# EAGLE design Solar LEDs (EAGLE 9.6.2)
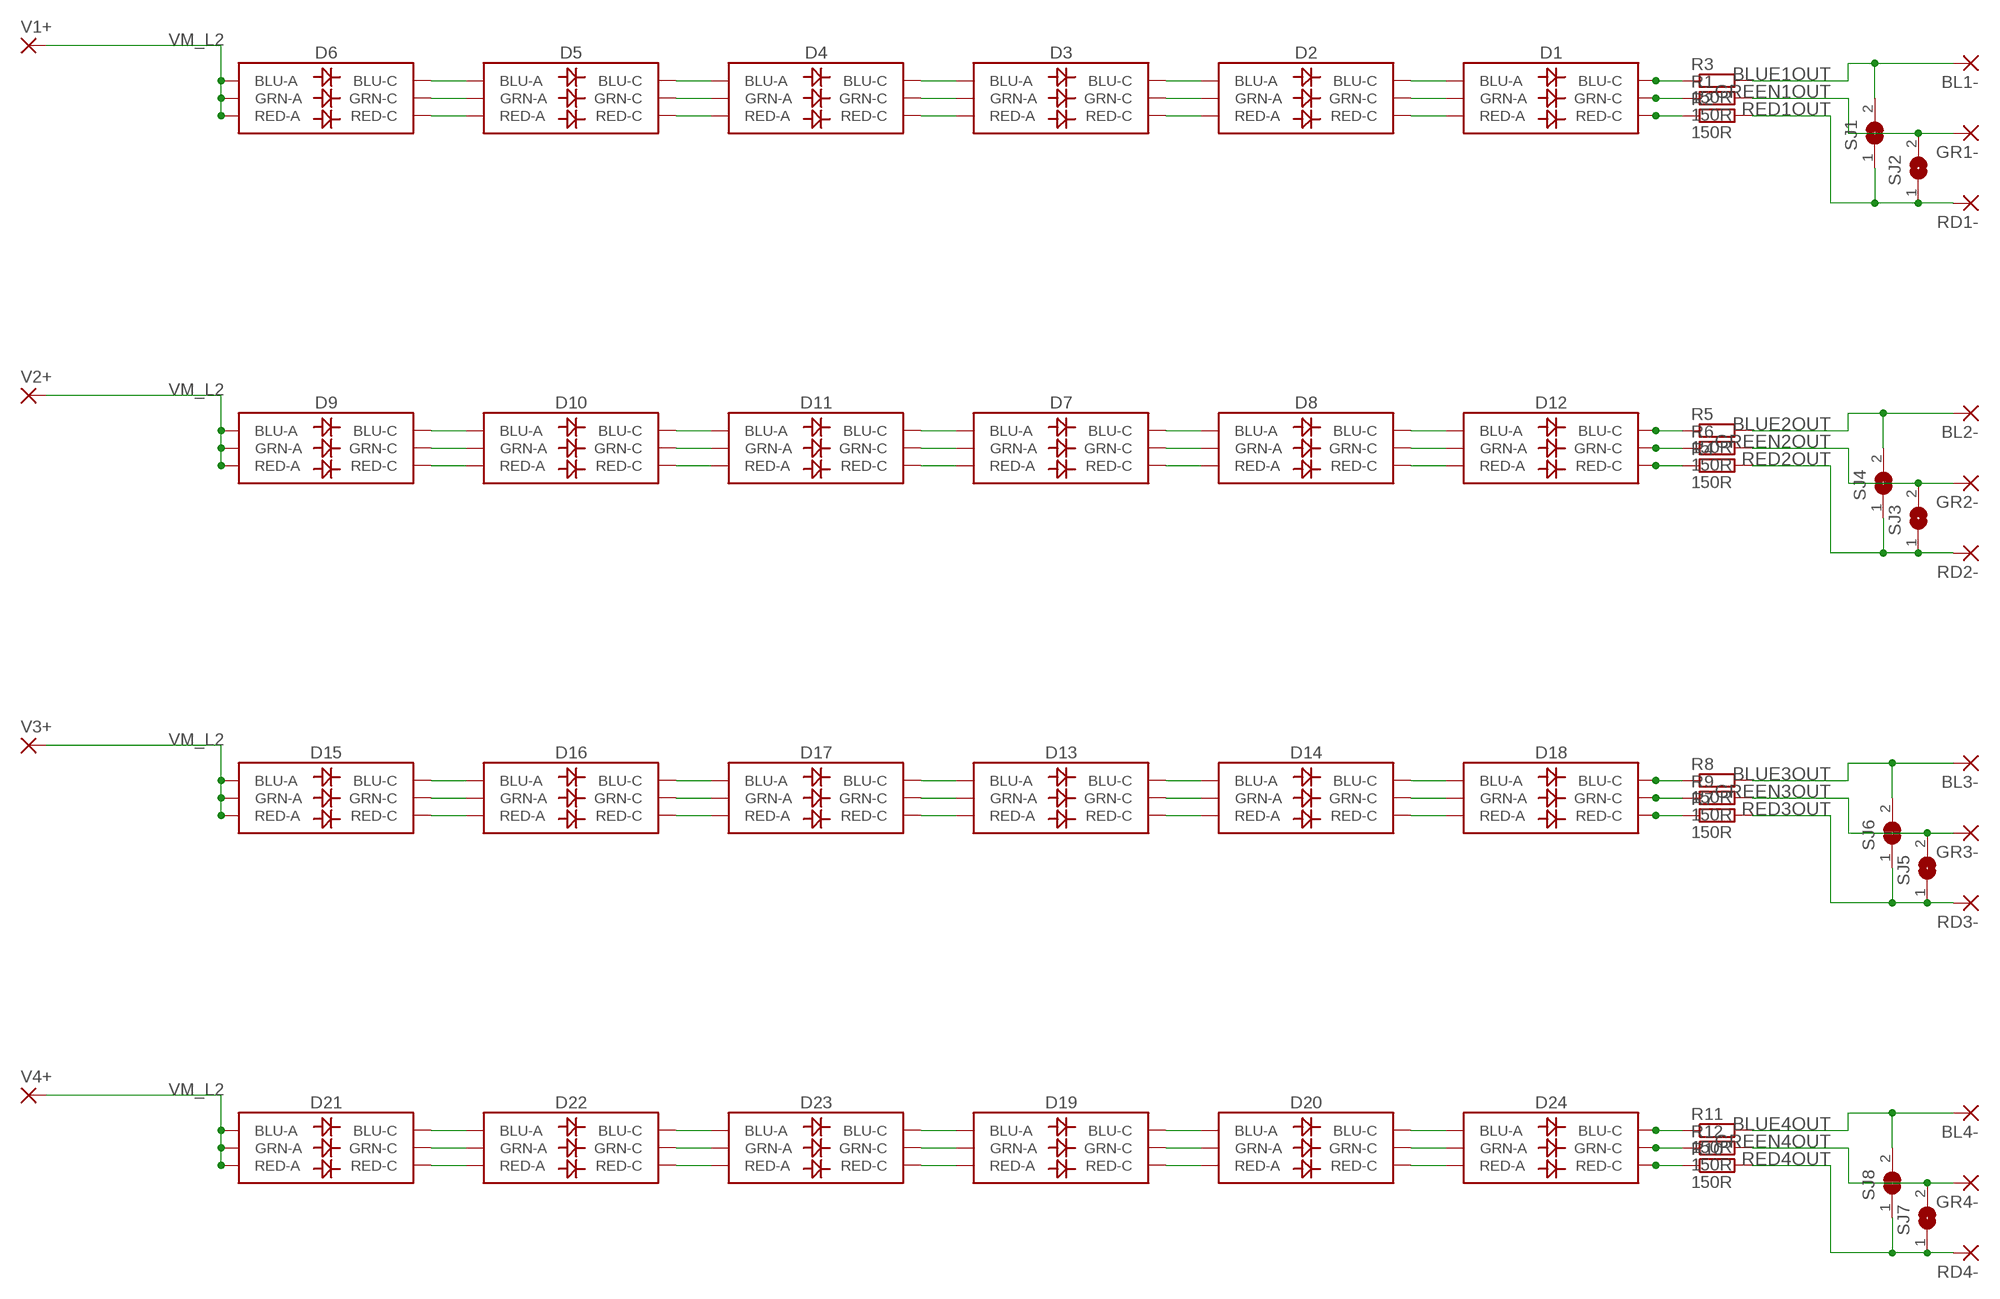
[diagram p0: schematic, sheet 1]

## Parts
BL1-  2,54/1,0  [2,54/1,0]
BL2-  2,54/1,0  [2,54/1,0]
BL3-  2,54/1,0  [2,54/1,0]
BL4-  2,54/1,0  [2,54/1,0]
D1  LED-RGBNO_IC  [LED-TRICOLOR-5050]
D2  LED-RGBNO_IC  [LED-TRICOLOR-5050]
D3  LED-RGBNO_IC  [LED-TRICOLOR-5050]
D4  LED-RGBNO_IC  [LED-TRICOLOR-5050]
D5  LED-RGBNO_IC  [LED-TRICOLOR-5050]
D6  LED-RGBNO_IC  [LED-TRICOLOR-5050]
D7  LED-RGBNO_IC  [LED-TRICOLOR-5050]
D8  LED-RGBNO_IC  [LED-TRICOLOR-5050]
D9  LED-RGBNO_IC  [LED-TRICOLOR-5050]
D10  LED-RGBNO_IC  [LED-TRICOLOR-5050]
D11  LED-RGBNO_IC  [LED-TRICOLOR-5050]
D12  LED-RGBNO_IC  [LED-TRICOLOR-5050]
D13  LED-RGBNO_IC  [LED-TRICOLOR-5050]
D14  LED-RGBNO_IC  [LED-TRICOLOR-5050]
D15  LED-RGBNO_IC  [LED-TRICOLOR-5050]
D16  LED-RGBNO_IC  [LED-TRICOLOR-5050]
D17  LED-RGBNO_IC  [LED-TRICOLOR-5050]
D18  LED-RGBNO_IC  [LED-TRICOLOR-5050]
D19  LED-RGBNO_IC  [LED-TRICOLOR-5050]
D20  LED-RGBNO_IC  [LED-TRICOLOR-5050]
D21  LED-RGBNO_IC  [LED-TRICOLOR-5050]
D22  LED-RGBNO_IC  [LED-TRICOLOR-5050]
D23  LED-RGBNO_IC  [LED-TRICOLOR-5050]
D24  LED-RGBNO_IC  [LED-TRICOLOR-5050]
GR1-  2,54/1,0  [2,54/1,0]
GR2-  2,54/1,0  [2,54/1,0]
GR3-  2,54/1,0  [2,54/1,0]
GR4-  2,54/1,0  [2,54/1,0]
R1  150R  R-EU_M1206  [M1206]
R2  150R  R-EU_M1206  [M1206]
R3  150R  R-EU_M1206  [M1206]
R4  150R  R-EU_M1206  [M1206]
R5  150R  R-EU_M1206  [M1206]
R6  150R  R-EU_M1206  [M1206]
R7  150R  R-EU_M1206  [M1206]
R8  150R  R-EU_M1206  [M1206]
R9  150R  R-EU_M1206  [M1206]
R10  150R  R-EU_M1206  [M1206]
R11  150R  R-EU_M1206  [M1206]
R12  150R  R-EU_M1206  [M1206]
RD1-  2,54/1,0  [2,54/1,0]
RD2-  2,54/1,0  [2,54/1,0]
RD3-  2,54/1,0  [2,54/1,0]
RD4-  2,54/1,0  [2,54/1,0]
SJ1  SJ  [SJ]
SJ2  SJ  [SJ]
SJ3  SJ  [SJ]
SJ4  SJ  [SJ]
SJ5  SJ  [SJ]
SJ6  SJ  [SJ]
SJ7  SJ  [SJ]
SJ8  SJ  [SJ]
V1+  2,54/1,0  [2,54/1,0]
V2+  2,54/1,0  [2,54/1,0]
V3+  2,54/1,0  [2,54/1,0]
V4+  2,54/1,0  [2,54/1,0]

## Nets
BLUE1OUT: BL1-.1(P) R3.2 SJ1.2
BLUE2OUT: BL2-.1(P) R5.2 SJ4.2
BLUE3OUT: BL3-.1(P) R8.2 SJ6.2
BLUE4OUT: BL4-.1(P) R11.2 SJ8.2
GREEN1OUT: GR1-.1(P) R1.2 SJ2.2
GREEN2OUT: GR2-.1(P) R6.2 SJ3.2
GREEN3OUT: GR3-.1(P) R9.2 SJ5.2
GREEN4OUT: GR4-.1(P) R12.2 SJ7.2
N$2: D9.4(BLU-C) D10.3(BLU-A)
N$3: D9.6(GRN-C) D10.1(GRN-A)
N$4: D9.5(RED-C) D10.2(RED-A)
N$5: D10.4(BLU-C) D11.3(BLU-A)
N$6: D10.6(GRN-C) D11.1(GRN-A)
N$7: D10.5(RED-C) D11.2(RED-A)
N$8: D7.3(BLU-A) D11.4(BLU-C)
N$9: D7.1(GRN-A) D11.6(GRN-C)
N$10: D7.2(RED-A) D11.5(RED-C)
N$11: D7.4(BLU-C) D8.3(BLU-A)
N$12: D7.6(GRN-C) D8.1(GRN-A)
N$13: D7.5(RED-C) D8.2(RED-A)
N$14: D8.4(BLU-C) D12.3(BLU-A)
N$15: D8.6(GRN-C) D12.1(GRN-A)
N$16: D8.5(RED-C) D12.2(RED-A)
N$17: D12.4(BLU-C) R5.1
N$18: D12.6(GRN-C) R6.1
N$19: D5.3(BLU-A) D6.4(BLU-C)
N$20: D5.1(GRN-A) D6.6(GRN-C)
N$21: D5.2(RED-A) D6.5(RED-C)
N$22: D4.3(BLU-A) D5.4(BLU-C)
N$23: D4.1(GRN-A) D5.6(GRN-C)
N$24: D4.2(RED-A) D5.5(RED-C)
N$25: D3.3(BLU-A) D4.4(BLU-C)
N$26: D3.1(GRN-A) D4.6(GRN-C)
N$27: D3.2(RED-A) D4.5(RED-C)
N$28: D2.3(BLU-A) D3.4(BLU-C)
N$29: D2.1(GRN-A) D3.6(GRN-C)
N$30: D2.2(RED-A) D3.5(RED-C)
N$31: D1.3(BLU-A) D2.4(BLU-C)
N$32: D1.1(GRN-A) D2.6(GRN-C)
N$33: D1.2(RED-A) D2.5(RED-C)
N$34: D12.5(RED-C) R4.1
N$35: D15.4(BLU-C) D16.3(BLU-A)
N$36: D15.6(GRN-C) D16.1(GRN-A)
N$37: D15.5(RED-C) D16.2(RED-A)
N$38: D16.4(BLU-C) D17.3(BLU-A)
N$39: D16.6(GRN-C) D17.1(GRN-A)
N$40: D16.5(RED-C) D17.2(RED-A)
N$41: D13.3(BLU-A) D17.4(BLU-C)
N$42: D13.1(GRN-A) D17.6(GRN-C)
N$43: D1.4(BLU-C) R3.1
N$44: D1.6(GRN-C) R1.1
N$45: D1.5(RED-C) R2.1
N$46: D13.2(RED-A) D17.5(RED-C)
N$47: D13.4(BLU-C) D14.3(BLU-A)
N$48: D13.6(GRN-C) D14.1(GRN-A)
N$49: D13.5(RED-C) D14.2(RED-A)
N$50: D14.4(BLU-C) D18.3(BLU-A)
N$51: D14.6(GRN-C) D18.1(GRN-A)
N$52: D14.5(RED-C) D18.2(RED-A)
N$53: D18.4(BLU-C) R8.1
N$54: D18.6(GRN-C) R9.1
N$55: D18.5(RED-C) R7.1
N$56: D21.4(BLU-C) D22.3(BLU-A)
N$57: D21.6(GRN-C) D22.1(GRN-A)
N$58: D21.5(RED-C) D22.2(RED-A)
N$59: D22.4(BLU-C) D23.3(BLU-A)
N$60: D22.6(GRN-C) D23.1(GRN-A)
N$61: D22.5(RED-C) D23.2(RED-A)
N$62: D19.3(BLU-A) D23.4(BLU-C)
N$63: D19.1(GRN-A) D23.6(GRN-C)
N$64: D19.2(RED-A) D23.5(RED-C)
N$65: D19.4(BLU-C) D20.3(BLU-A)
N$66: D19.6(GRN-C) D20.1(GRN-A)
N$67: D19.5(RED-C) D20.2(RED-A)
N$68: D20.4(BLU-C) D24.3(BLU-A)
N$69: D20.6(GRN-C) D24.1(GRN-A)
N$70: D20.5(RED-C) D24.2(RED-A)
N$71: D24.4(BLU-C) R11.1
N$72: D24.6(GRN-C) R12.1
N$73: D24.5(RED-C) R10.1
RED1OUT: R2.2 RD1-.1(P) SJ1.1 SJ2.1
RED2OUT: R4.2 RD2-.1(P) SJ3.1 SJ4.1
RED3OUT: R7.2 RD3-.1(P) SJ5.1 SJ6.1
RED4OUT: R10.2 RD4-.1(P) SJ7.1 SJ8.1
VM_L2: D6.1(GRN-A) D6.2(RED-A) D6.3(BLU-A) D9.1(GRN-A) D9.2(RED-A) D9.3(BLU-A) D15.1(GRN-A) D15.2(RED-A) D15.3(BLU-A) D21.1(GRN-A) D21.2(RED-A) D21.3(BLU-A) V1+.1(P) V2+.1(P) V3+.1(P) V4+.1(P)

## Library data of the parts
BL1- BL2- BL3- BL4- GR1- GR2- GR3- GR4- RD1- RD2- RD3- RD4- V1+ V2+ V3+ V4+ = wirepad:2,54/1,0: THROUGH-HOLE PAD
D1-D24 = SparkFun-LED:LED-RGB: LED-RGB 6 pin RGB LED (no common connector) Packages: PLCC-6 LED-TRICOLOR-5050 - No built-in IC SparkFun Products: Digital Sandbox <https://www.sparkfun.com/products/12651> LED- SMD RGB <https://www.sparkfun.com/products/10866>; PROD_ID: DIO-10298
R1-R12 = rcl:R-EU_: RESISTOR, European symbol
SJ1-SJ8 = jumper:SJ: SMD solder JUMPER

## Net classes
0 default: width 0.203 mm, clearance 0.152 mm

## Board
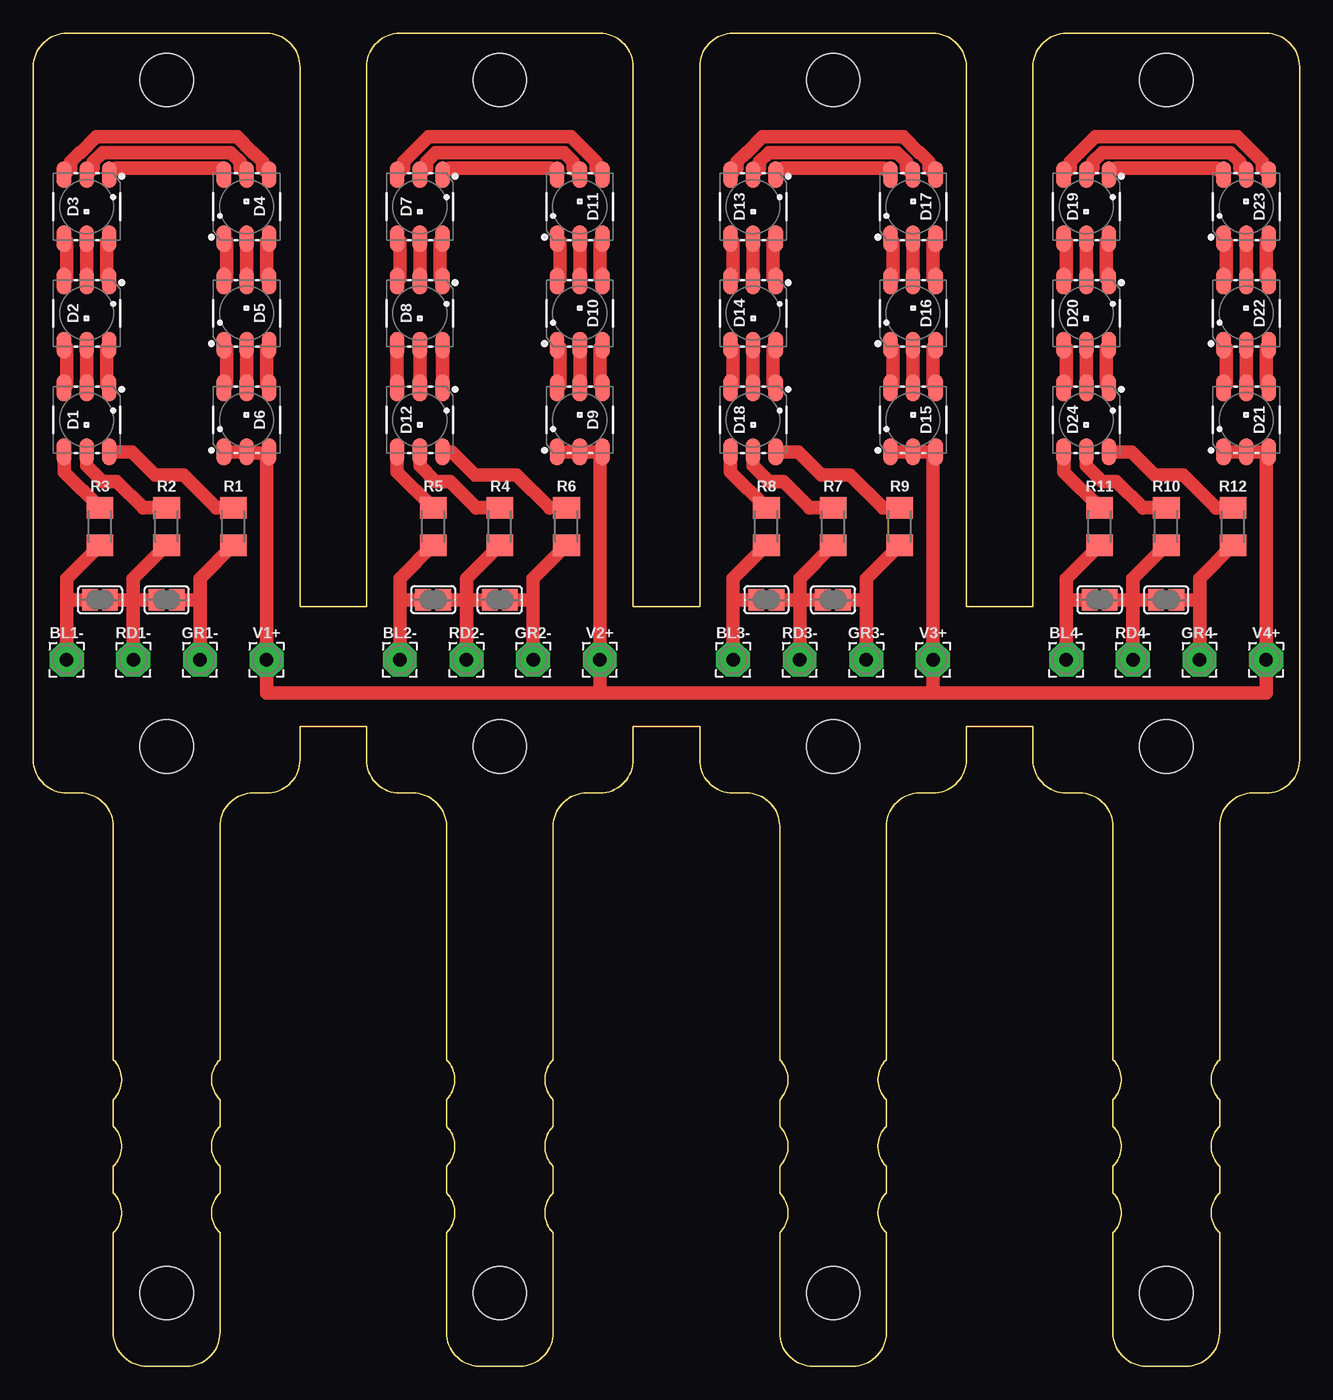
[diagram p1: board, top side]

Size 95 x 100 mm. Coordinates in mm from the lower left corner, seen from the top.
Outline: 41.5,43 arc90 39,40.5
Outline: 56,40.5 arc90 53.5,43
Outline: 66.5,43 arc90 64,40.5
Outline: 81,40.5 arc90 78.5,43
Outline: 31,2.5 arc90 33.5,0
Outline: 36.5,0 arc90 39,2.5
Outline: 56,2.5 arc90 58.5,0
Outline: 61.5,0 arc90 64,2.5
Outline: 81,2.5 arc90 83.5,0
Outline: 86.5,0 arc90 89,2.5
Outline: 53.5,43 52.5,43 arc-90 50,45.5 50,48 45,48 45,45.5 arc-90 42.5,43 41.5,43
Outline: 41.5,43 arc90 39,40.5
Outline: 56,40.5 arc90 53.5,43
Outline: 78.5,43 77.5,43 arc-90 75,45.5 75,48 70,48 70,45.5 arc-90 67.5,43 66.5,43
Outline: 66.5,43 arc90 64,40.5
Outline: 81,40.5 arc90 78.5,43
Outline: 33.5,0 36.5,0
Outline: 36.5,0 arc90 39,2.5
Outline: 31,2.5 arc90 33.5,0
Outline: 39,2.5 39,10 arc-90 39,13 39,15 arc-90 39,18 39,20 arc-90 39,23 39,40.5
Outline: 31,2.5 31,10 arc90 31,13 31,15 arc90 31,18 31,20 arc90 31,23 31,40.5 arc90 28.5,43 27.5,43 arc-90 25,45.5 25,48 20,48 20,45.5 arc-90 17.5,43 16.5,43 arc90 14,40.5 14,23 arc90 14,20 14,18 arc90 14,15 14,13 arc90 14,10 14,2.5 arc-90 11.5,0 8.5,0 arc-90 6,2.5 6,10 arc90 6,13 6,15 arc90 6,18 6,20 arc90 6,23 6,40.5 arc90 3.5,43 2.5,43 arc-90 0,45.5 0,97.5 arc-90 2.5,100 17.5,100 arc-90 20,97.5 20,57 25,57 25,97.5 arc-90 27.5,100 42.5,100 arc-90 45,97.5 45,57 50,57 50,97.5 arc-90 52.5,100 67.5,100 arc-90 70,97.5 70,57 75,57 75,97.5 arc-90 77.5,100 92.5,100 arc-90 95,97.5 95,45.5 arc-90 92.5,43 91.5,43 arc90 89,40.5 89,23 arc90 89,20 89,18 arc90 89,15 89,13 arc90 89,10 89,2.5
Outline: 58.5,0 61.5,0
Outline: 61.5,0 arc90 64,2.5
Outline: 56,2.5 arc90 58.5,0
Outline: 64,2.5 64,10 arc-90 64,13 64,15 arc-90 64,18 64,20 arc-90 64,23 64,40.5
Outline: 56,2.5 56,10 arc90 56,13 56,15 arc90 56,18 56,20 arc90 56,23 56,40.5
Outline: 83.5,0 86.5,0
Outline: 86.5,0 arc90 89,2.5
Outline: 81,2.5 arc90 83.5,0
Outline: 81,2.5 81,10 arc90 81,13 81,15 arc90 81,18 81,20 arc90 81,23 81,40.5
Copper layers (1*16): Top 0.035mm / dielectric 1.5mm / Bottom 0.035mm
Design rules "default": minimum track width 6mil, minimum drill 0.35mm, track to track 6mil, track to pad 6mil, pad to pad 6mil, via to via 6mil, smd to smd 6mil, copper to edge 40mil, drill to drill 6mil, minimum pad ring 10mil, minimum via ring 8mil, stop-mask expansion 4mil, vias tented up to drill 0mil, thermal gap 10mil
Holes 4 mm at 10,46.5 35,46.5 60,46.5 85,46.5 10,5.5 35,5.5 60,5.5 85,5.5 10,96.5 35,96.5 60,96.5 85,96.5

### Footprints (pad centres in the part's own frame; a part is rotated, then mirrored left to right if it is on the bottom)
2,54/1,0 = drill 1.016 pad 2.54 octagon: 1 0,0
LED-TRICOLOR-5050 = smd 2 x 1.1: 1 -2.4,1.7; 2 -2.4,0; 3 -2.4,-1.7; 4 2.4,-1.7; 5 2.4,0; 6 2.4,1.7
M1206 = smd 1.6 x 2: 1 -1.4,0; 2 1.4,0
SJ = smd 1.168 x 1.6: 1 -0.762,0; 2 0.762,0

### Placement (x,y rotation side)
BL1-  2.5,53 0 top
BL2-  27.5,53 0 top
BL3-  52.5,53 0 top
BL4-  77.5,53 0 top
D1  4,71 270 top
D2  4,79 270 top
D3  4,87 270 top
D4  16,87 90 top
D5  16,79 90 top
D6  16,71 90 top
D7  29,87 270 top
D8  29,79 270 top
D9  41,71 90 top
D10  41,79 90 top
D11  41,87 90 top
D12  29,71 270 top
D13  54,87 270 top
D14  54,79 270 top
D15  66,71 90 top
D16  66,79 90 top
D17  66,87 90 top
D18  54,71 270 top
D19  79,87 270 top
D20  79,79 270 top
D21  91,71 90 top
D22  91,79 90 top
D23  91,87 90 top
D24  79,71 270 top
GR1-  12.5,53 0 top
GR2-  37.5,53 0 top
GR3-  62.5,53 0 top
GR4-  87.5,53 0 top
R1  15,63 270 top
R2  10,63 270 top
R3  5,63 270 top
R4  35,63 270 top
R5  30,63 270 top
R6  40,63 270 top
R7  60,63 270 top
R8  55,63 270 top
R9  65,63 270 top
R10  85,63 270 top
R11  80,63 270 top
R12  90,63 270 top
RD1-  7.5,53 0 top
RD2-  32.5,53 0 top
RD3-  57.5,53 0 top
RD4-  82.5,53 0 top
SJ1  5,57.5 180 top
SJ2  10,57.5 0 top
SJ3  35,57.5 0 top
SJ4  30,57.5 180 top
SJ5  60,57.5 0 top
SJ6  55,57.5 180 top
SJ7  85,57.5 0 top
SJ8  80,57.5 180 top
V1+  17.5,53 0 top
V2+  42.5,53 0 top
V3+  67.5,53 0 top
V4+  92.5,53 0 top

### Tracks (layer width: path | path; a pad name or v marks a point on that pad's centre or on a via)
BLUE1OUT
  Top 1.016: BL1-.1 2.5,57.5 | 2.5,57.5 2.5,59.1 R3.2 | SJ1.2 2.5,57.5
BLUE2OUT
  Top 1.016: BL2-.1 27.5,57.5 | 27.5,57.5 27.5,59.1 R5.2 | SJ4.2 27.5,57.5
BLUE3OUT
  Top 1.016: BL3-.1 52.5,57.5 | 52.5,57.5 52.5,59.1 R8.2 | SJ6.2 52.5,57.5
BLUE4OUT
  Top 1.016: BL4-.1 77.5,57.5 | 77.5,57.5 77.5,59.1 R11.2 | SJ8.2 77.5,57.5
GREEN1OUT
  Top 1.016: GR1-.1 12.5,57.5 | 12.5,57.5 12.5,59.1 R1.2 | SJ2.2 12.5,57.5
GREEN2OUT
  Top 1.016: GR2-.1 37.5,57.5 | 37.5,57.5 37.5,59.1 R6.2 | SJ3.2 37.5,57.5
GREEN3OUT
  Top 1.016: GR3-.1 62.5,57.5 | 62.5,57.5 62.5,59.1 R9.2 | SJ5.2 62.5,57.5
GREEN4OUT
  Top 1.016: GR4-.1 87.5,57.5 | 87.5,57.5 87.5,59.1 R12.2 | SJ7.2 87.5,57.5
N$2
  Top 1.016: D10.3 42.5,76.4 42.5,73.6 D9.4
N$3
  Top 1.016: D10.1 39.5,76.4 39.5,73.6 D9.6
N$4
  Top 1.016: D9.5 D10.2
N$5
  Top 1.016: D11.3 42.5,84.4 42.5,81.6 D10.4
N$6
  Top 1.016: D11.1 39.5,84.4 39.5,81.6 D10.6
N$7
  Top 1.016: D11.2 D10.5
N$8
  Top 1.016: D11.4 42.21,89.89 42.21,90.35 40.33,92.23 29.67,92.23 27.79,90.35 27.79,89.89 D7.3
N$9
  Top 1.016: D7.1 31.19,89.89 38.81,89.89 D11.6
N$10
  Top 1.016: D7.2 29.49,89.89 29.49,90.35 30.2,91.06 39.8,91.06 40.51,90.35 40.51,89.89 D11.5
N$11
  Top 1.016: D8.3 27.5,81.6 27.5,84.4 D7.4
N$12
  Top 1.016: D7.6 30.5,84.4 30.5,81.6 D8.1
N$13
  Top 1.016: D8.2 D7.5
N$14
  Top 1.016: D12.3 D8.4
N$15
  Top 1.016: D12.1 D8.6
N$16
  Top 1.016: D12.2 D8.5
N$17
  Top 1.016: D12.4 27.3,67.1 R5.1
N$18
  Top 1.016: R6.1 38.73,64.4 36.27,66.86 33.14,66.86 31.4,68.6 D12.6
N$19
  Top 1.016: D5.3 17.5,76.4 17.5,73.6 D6.4
N$20
  Top 1.016: D5.1 14.5,76.4 14.5,73.6 D6.6
N$21
  Top 1.016: D6.5 D5.2
N$22
  Top 1.016: D4.3 17.5,84.4 17.5,81.6 D5.4
N$23
  Top 1.016: D4.1 14.5,84.4 14.5,81.6 D5.6
N$24
  Top 1.016: D5.5 D4.2
N$25
  Top 1.016: D4.4 17.21,89.89 17.21,90.35 16.5,91.06 16.45,91.06 15.29,92.23 4.71,92.23 3.55,91.06 3.5,91.06 2.79,90.35 2.79,89.89 D3.3
N$26
  Top 1.016: D3.1 6.19,89.89 14,89.89 14.3,89.59 D4.6
N$27
  Top 1.016: D3.2 4.49,89.89 4.49,90.35 5.2,91.06 14.8,91.06 15.51,90.35 15.51,89.89 D4.5
N$28
  Top 1.016: D3.4 2.5,84.4 2.5,81.6 D2.3
N$29
  Top 1.016: D2.1 5.5,81.6 5.5,84.4 D3.6
N$30
  Top 1.016: D3.5 D2.2
N$31
  Top 1.016: D2.4 2.5,76.4 2.5,73.6 D1.3
N$32
  Top 1.016: D2.6 5.5,76.4 5.5,73.6 D1.1
N$33
  Top 1.016: D1.2 D2.5
N$34
  Top 1.016: D12.5 29,67.55 30.19,66.36 31.27,66.36 33.23,64.4 R4.1
N$35
  Top 1.016: D15.4 67.5,73.6 67.5,76.4 D16.3
N$36
  Top 1.016: D15.6 64.5,73.6 64.5,76.4 D16.1
N$37
  Top 1.016: D15.5 D16.2
N$38
  Top 1.016: D16.4 67.5,81.6 67.5,84.4 D17.3
N$39
  Top 1.016: D17.1 64.5,84.4 64.5,81.6 D16.6
N$40
  Top 1.016: D16.5 D17.2
N$41
  Top 1.016: D17.4 67.21,89.89 67.21,90.35 66.5,91.06 66.45,91.06 65.28,92.23 54.72,92.23 53.55,91.06 53.5,91.06 52.79,90.35 52.79,89.89 D13.3
N$42
  Top 1.016: D13.1 56.19,89.89 63.81,89.89 D17.6
N$43
  Top 1.016: D1.4 2.3,67.1 R3.1
N$44
  Top 1.016: R1.1 13.73,64.4 11.27,66.86 9.14,66.86 7.4,68.6 D1.6
N$45
  Top 1.016: D1.5 4,67.55 5.19,66.36 6.27,66.36 8.23,64.4 R2.1
N$46
  Top 1.016: D13.2 54.49,89.89 54.49,90.35 55.2,91.06 64.8,91.06 65.51,90.35 65.51,89.89 D17.5
N$47
  Top 1.016: D14.3 52.5,81.6 52.5,84.4 D13.4
N$48
  Top 1.016: D13.6 55.5,84.4 55.5,81.6 D14.1
N$49
  Top 1.016: D14.2 D13.5
N$50
  Top 1.016: D14.4 52.5,76.4 52.5,73.6 D18.3
N$51
  Top 1.016: D18.1 55.5,73.6 55.5,76.4 D14.6
N$52
  Top 1.016: D18.2 D14.5
N$53
  Top 1.016: D18.4 52.3,67.1 R8.1
N$54
  Top 1.016: R9.1 63.73,64.4 61.27,66.86 59.14,66.86 57.4,68.6 D18.6
N$55
  Top 1.016: D18.5 54,67.55 55.19,66.36 56.27,66.36 58.23,64.4 R7.1
N$56
  Top 1.016: D22.3 92.5,76.4 92.5,73.6 D21.4
N$57
  Top 1.016: D21.6 89.5,73.6 89.5,76.4 D22.1
N$58
  Top 1.016: D21.5 D22.2
N$59
  Top 1.016: D22.4 92.5,81.6 92.5,84.4 D23.3
N$60
  Top 1.016: D22.6 89.5,81.6 89.5,84.4 D23.1
N$61
  Top 1.016: D23.2 D22.5
N$62
  Top 1.016: D19.3 77.79,89.89 77.79,90.35 79.67,92.23 90.33,92.23 92.21,90.35 92.21,89.89 D23.4
N$63
  Top 1.016: D23.6 88.81,89.89 81.19,89.89 D19.1
N$64
  Top 1.016: D19.2 79.49,89.89 79.49,90.35 80.2,91.06 89.8,91.06 90.51,90.35 90.51,89.89 D23.5
N$65
  Top 1.016: D20.3 77.5,81.6 77.5,84.4 D19.4
N$66
  Top 1.016: D19.6 80.5,84.4 80.5,81.6 D20.1
N$67
  Top 1.016: D19.5 D20.2
N$68
  Top 1.016: D20.4 77.5,76.4 77.5,73.6 D24.3
N$69
  Top 1.016: D20.6 80.5,76.4 80.5,73.6 D24.1
N$70
  Top 1.016: D24.2 D20.5
N$71
  Top 1.016: D24.4 77.3,67.1 R11.1
N$72
  Top 1.016: R12.1 88.73,64.4 86.27,66.86 84.14,66.86 82.4,68.6 D24.6
N$73
  Top 1.016: D24.5 79,67.55 80.19,66.36 81.27,66.36 83.23,64.4 R10.1
RED1OUT
  Top 1.016: RD1-.1 7.5,57.5 | 7.5,57.5 7.5,59.1 R2.2 | SJ1.1 7.5,57.5 | SJ2.1 7.5,57.5
RED2OUT
  Top 1.016: RD2-.1 32.5,57.5 | 32.5,57.5 32.5,59.1 R4.2 | SJ4.1 32.5,57.5 | SJ3.1 32.5,57.5
RED3OUT
  Top 1.016: RD3-.1 57.5,57.5 | 57.5,57.5 57.5,59.1 R7.2 | SJ6.1 57.5,57.5 | SJ5.1 57.5,57.5
RED4OUT
  Top 1.016: RD4-.1 82.5,57.5 | 82.5,57.5 82.5,59.1 R10.2 | SJ8.1 82.5,57.5 | SJ7.1 82.5,57.5
VM_L2
  Top 1.016: D21.1 D21.2 D21.3 92.5,68.4 V4+.1 92.5,50.5 67.5,50.5 | D15.1 D15.2 D15.3 67.5,68.4 V3+.1 67.5,50.5 | D9.1 D9.2 D9.3 42.5,68.4 V2+.1 42.5,50.5 | 16,68.5 17.6,68.5 D6.3 17.5,68.4 V1+.1 17.5,50.5 42.5,50.5 | 16,68.5 D6.2 | D6.1 15.9,68.6 16,68.5 | 42.5,50.5 67.5,50.5